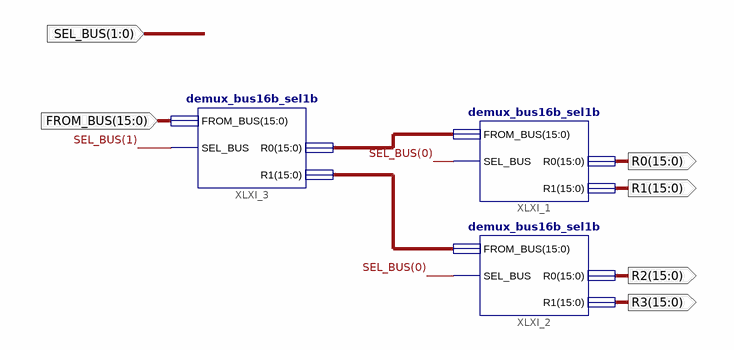
[diagram p0: schematic sheet 1]
// Xilinx ISE schematic demux_bus16b_sel2b.sch (artix7) as structural Verilog: 3 symbols, 6 ports
module demux_bus16b_sel2b (
  input  [1:0] SEL_BUS,
  input  [15:0] FROM_BUS,
  output [15:0] R0,
  output [15:0] R1,
  output [15:0] R2,
  output [15:0] R3
);

  wire [15:0] XLXN_3, XLXN_4;

  demux_bus16b_sel1b XLXI_1 (.SEL_BUS(SEL_BUS[0]), .FROM_BUS(XLXN_4), .R0(R0), .R1(R1));
  demux_bus16b_sel1b XLXI_2 (.SEL_BUS(SEL_BUS[0]), .FROM_BUS(XLXN_3), .R0(R2), .R1(R3));
  demux_bus16b_sel1b XLXI_3 (.SEL_BUS(SEL_BUS[1]), .FROM_BUS(FROM_BUS), .R0(XLXN_4), .R1(XLXN_3));
endmodule
